# EAGLE design top (EAGLE 9.6.2)
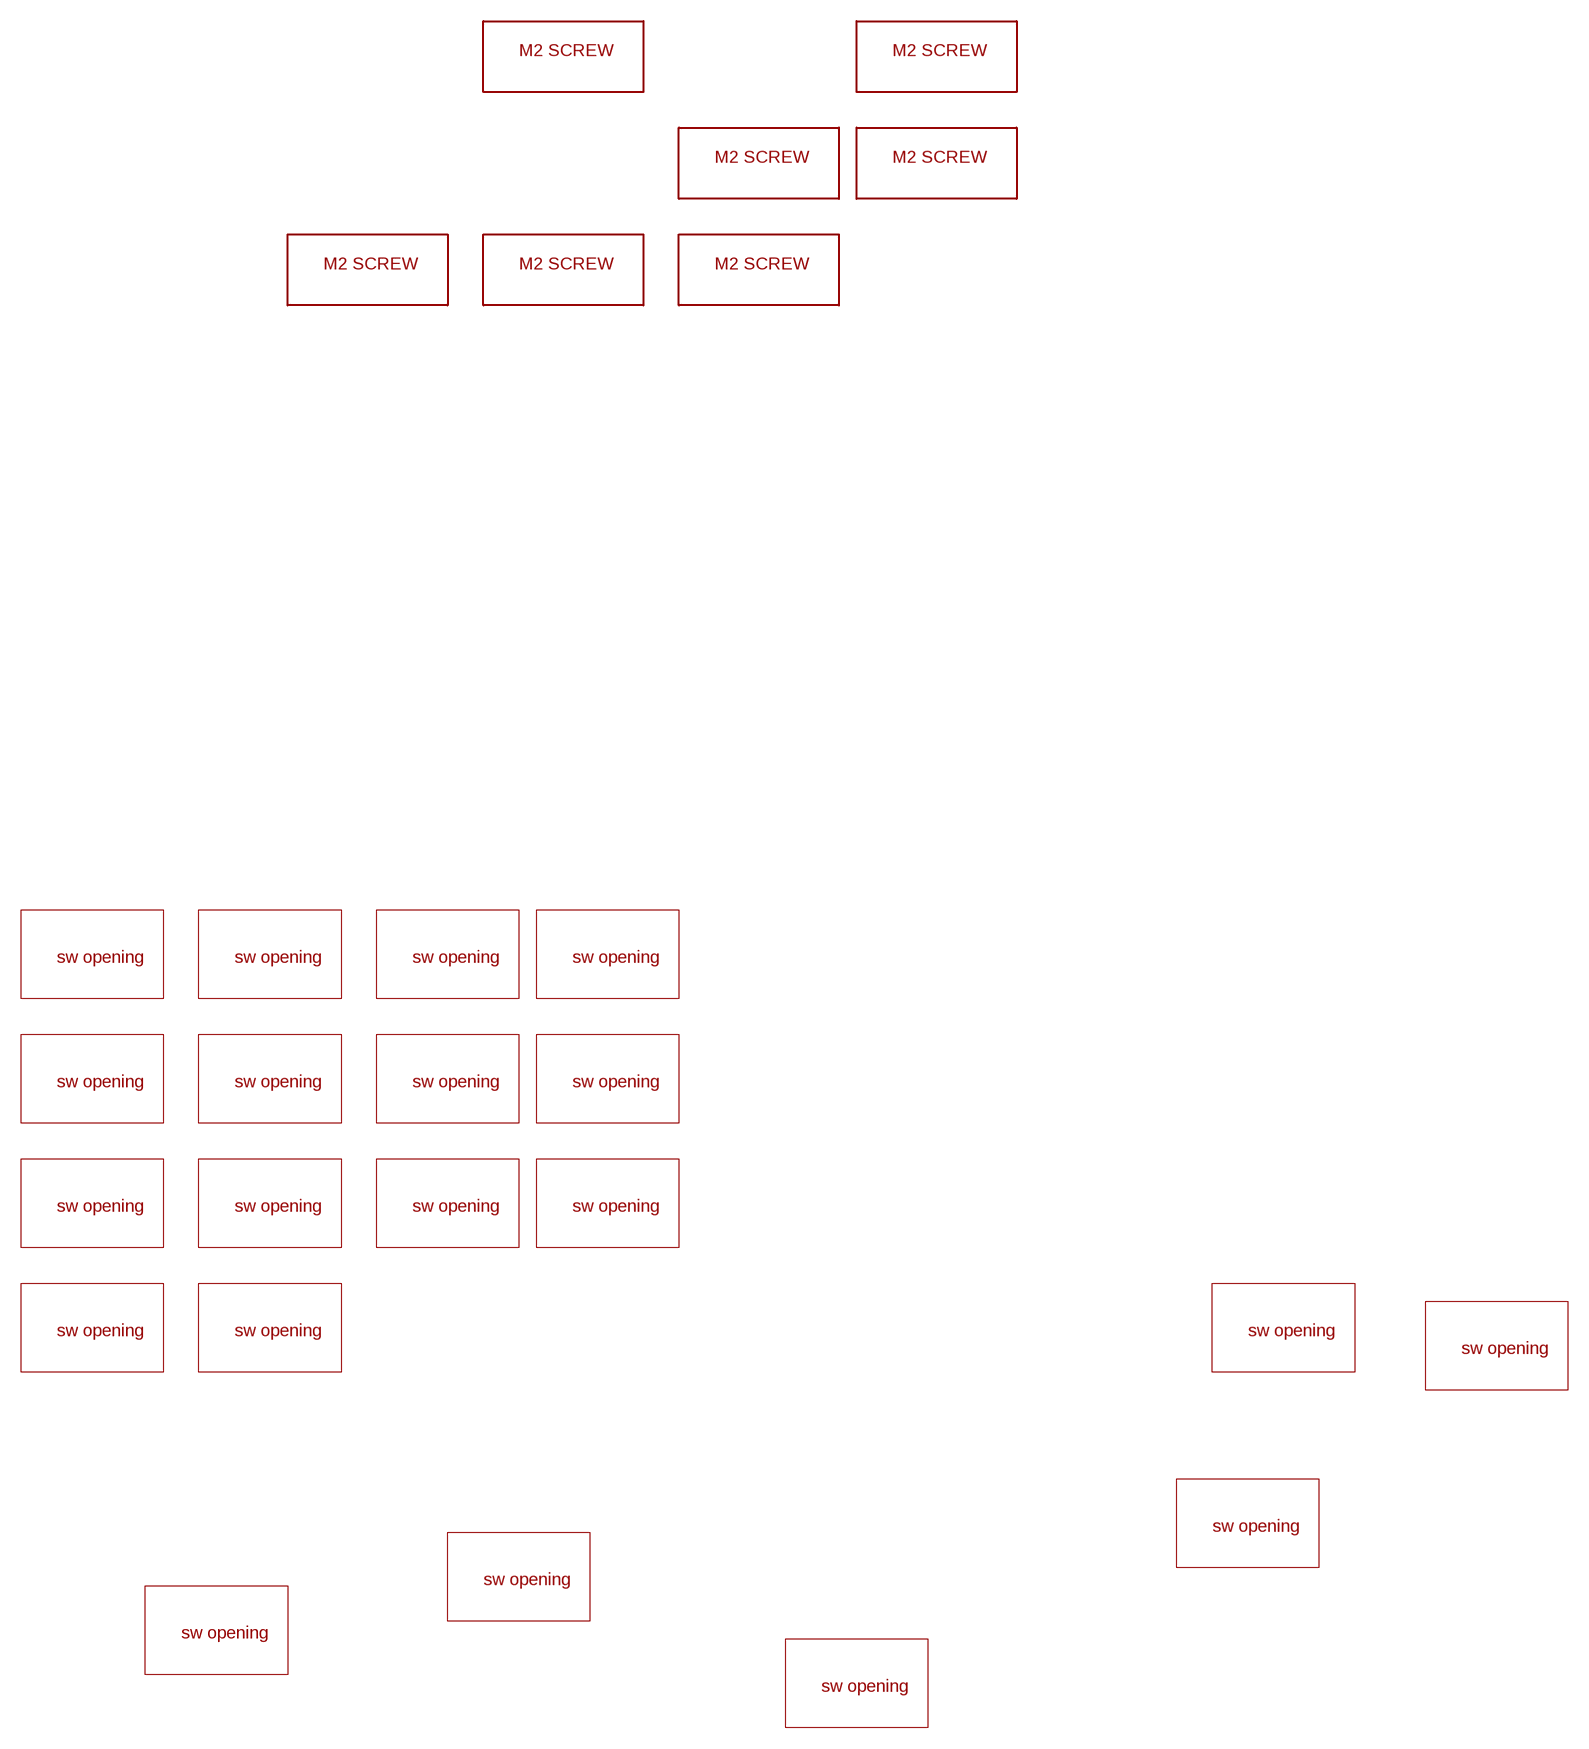
[diagram p0: schematic, sheet 1]

## Parts
U$1  SW_OPENM  [SW_OPENING]
U$2  SW_OPENM  [SW_OPENING]
U$3  SW_OPENM  [SW_OPENING]
U$4  SW_OPENM  [SW_OPENING]
U$5  SW_OPENM  [SW_OPENING]
U$6  SW_OPENM  [SW_OPENING]
U$7  SW_OPENM  [SW_OPENING]
U$8  M2_SCREW_DEV  [M2_SCREW_FOOT]
U$9  M2_SCREW_DEV  [M2_SCREW_FOOT]
U$10  SW_OPENM  [SW_OPENING]
U$11  SW_OPENM  [SW_OPENING]
U$12  M2_SCREW_DEV  [M2_SCREW_FOOT]
U$13  M2_SCREW_DEV  [M2_SCREW_FOOT]
U$14  M2_SCREW_DEV  [M2_SCREW_FOOT]
U$15  SW_OPENM  [SW_OPENING]
U$16  SW_OPENM  [SW_OPENING]
U$17  M2_SCREW_DEV  [M2_SCREW_FOOT]
U$18  SW_OPENM  [SW_OPENING]
U$19  SW_OPENM  [SW_OPENING]
U$20  SW_OPENM  [SW_OPENING]
U$21  SW_OPENM  [SW_OPENING]
U$22  M2_SCREW_DEV  [M2_SCREW_FOOT]
U$23  SW_OPENM  [SW_OPENING]
U$24  SW_OPENM  [SW_OPENING]
U$25  SW_OPENM  [SW_OPENING]
U$26  SW_OPENM  [SW_OPENING]
U$27  SW_OPENM  [SW_OPENING]

## Library data of the parts
U$1-U$7 U$10 U$11 U$15 U$16 U$18-U$21 U$23-U$27 = duckypad:SW_OPENM
U$8 U$9 U$12-U$14 U$17 U$22 = duckypad:M2_SCREW_DEV

## Board
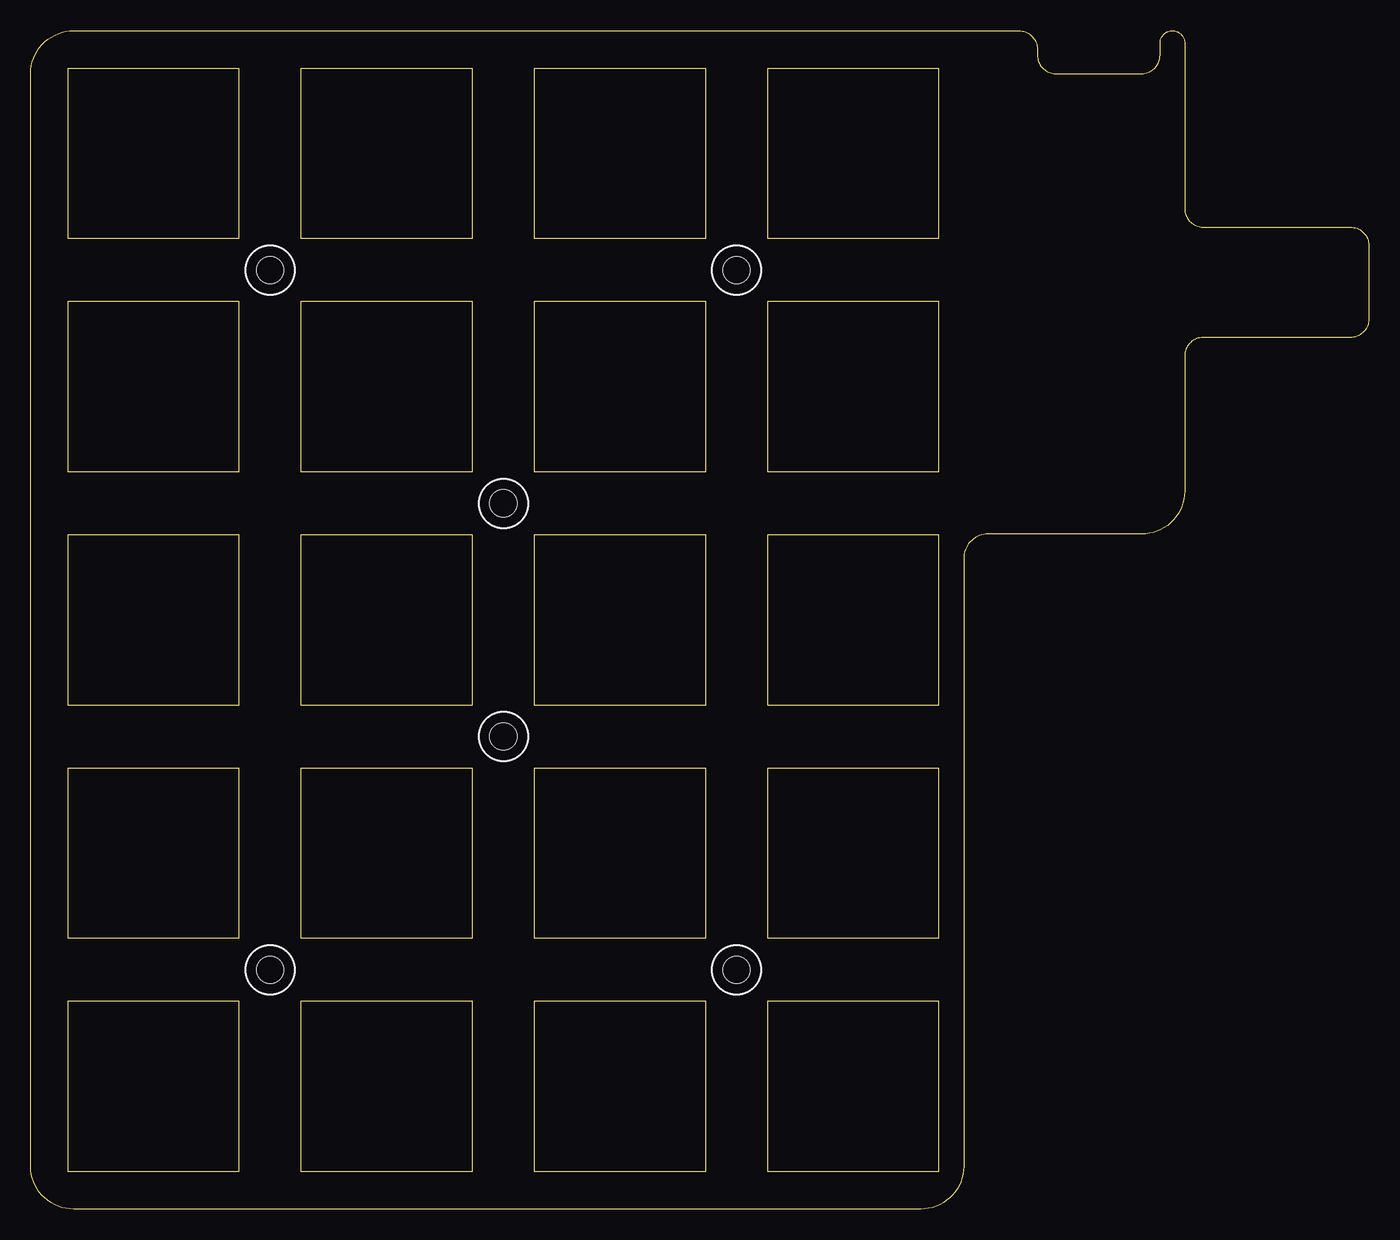
[diagram p1: board, top side]
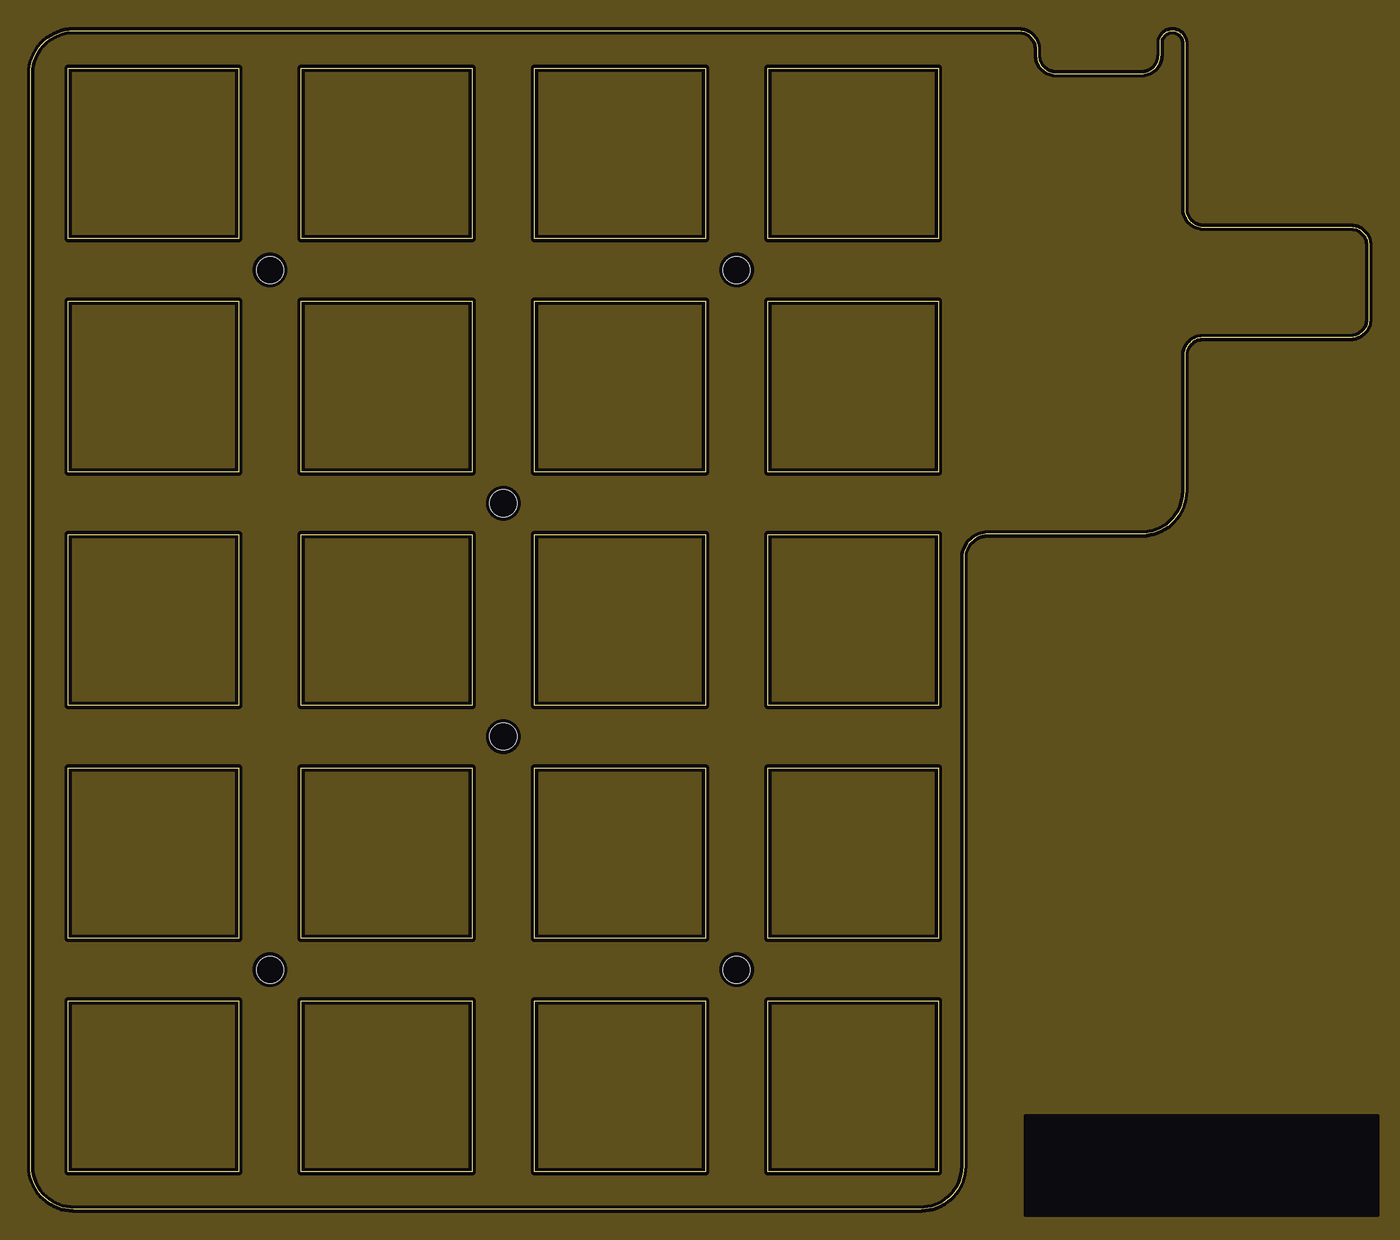
[diagram p2: board, inner layer pwr]
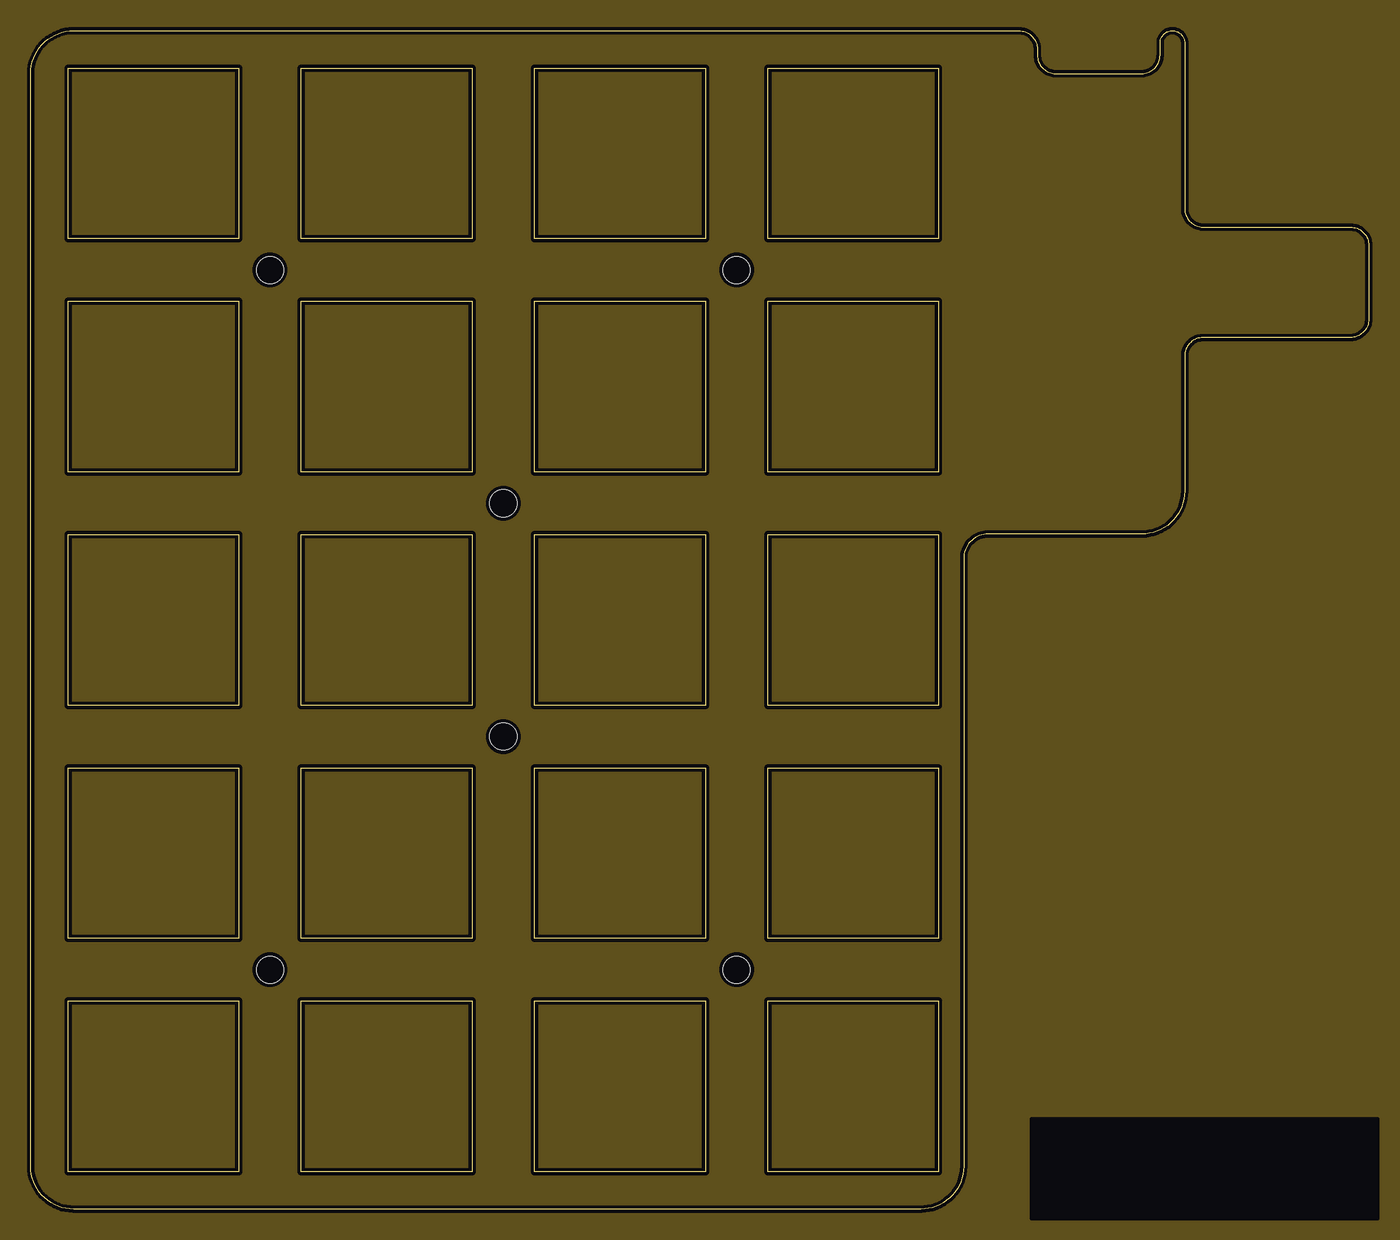
[diagram p3: board, inner layer gnd]
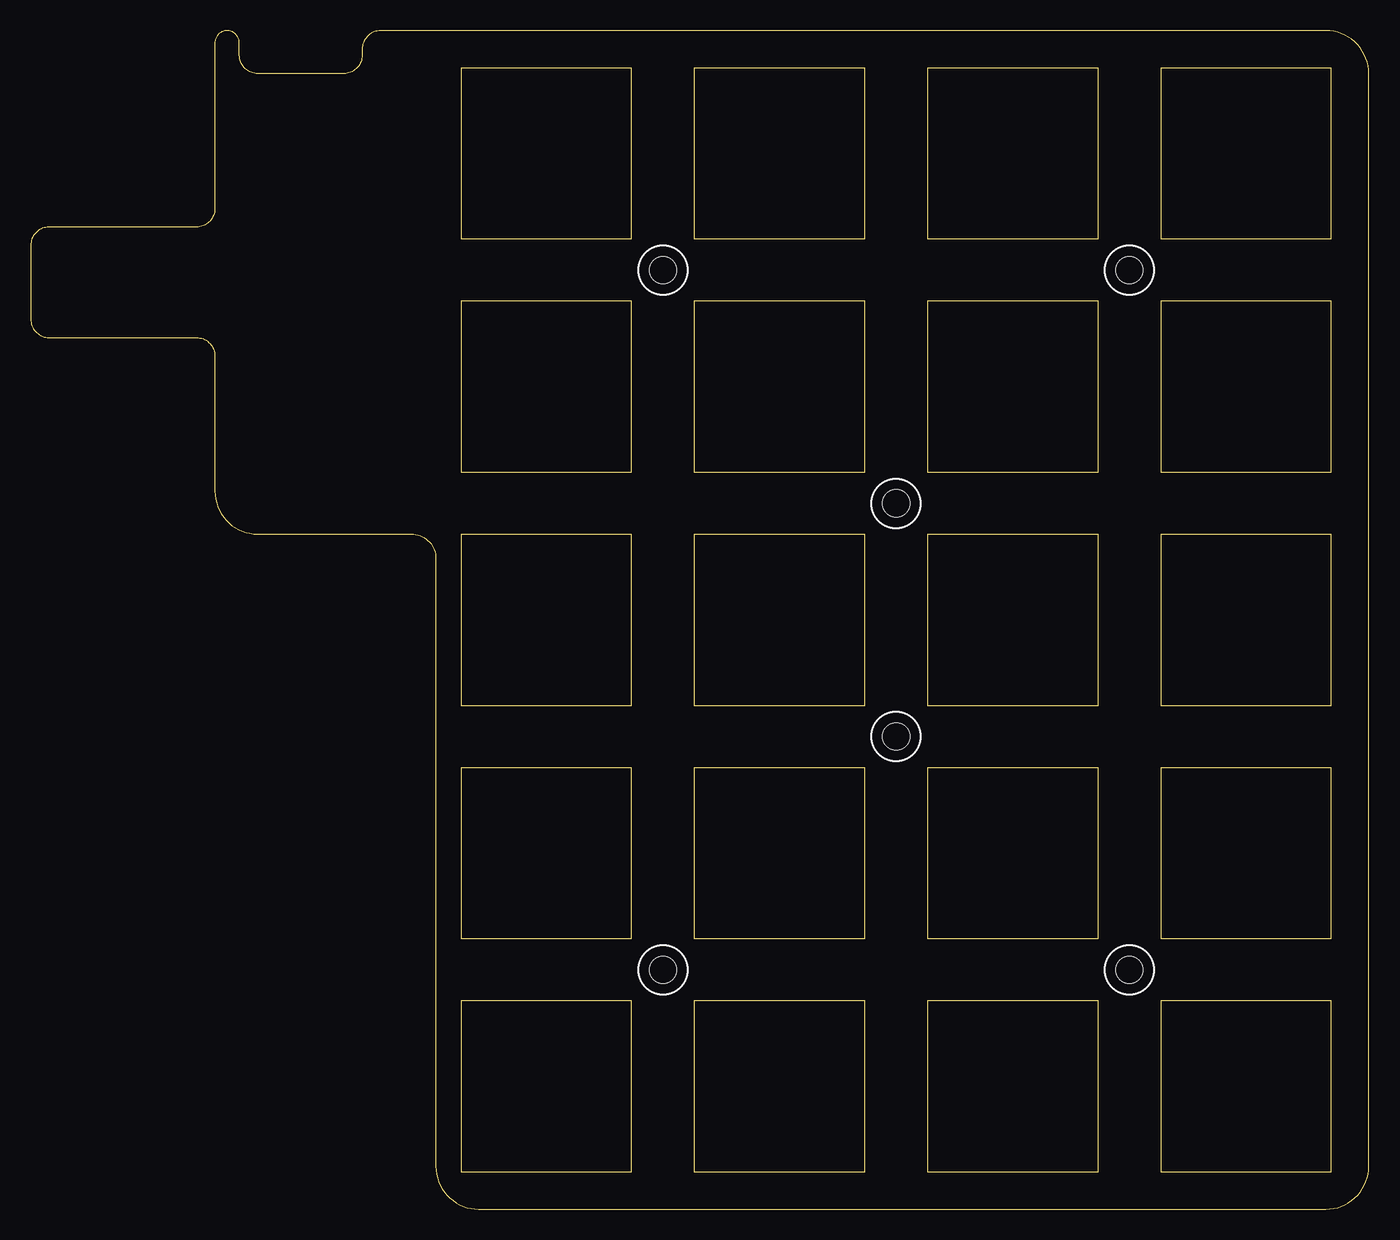
[diagram p4: board, bottom side, seen from below]

Size 109 x 96 mm. Coordinates in mm from the lower left corner, seen from the top.
Outline: 0,3.5 0,92.5 arc-90 3.5,96 80.5,96 arc-90 82,94.5 82,94 arc90 83.5,92.5 90.5,92.5 arc90 92,94 92,95 arc-90 93,96 arc-90 94,95 94,81.5 arc90 95.5,80 107.5,80 arc-90 109,78.5 109,72.5 arc-90 107.5,71 95.5,71 arc90 94,69.5 94,58.5 arc-90 90.5,55 78,55 arc90 76,53 76,3.5 arc-90 72.5,0 3.5,0 arc-90 0,3.5
Copper layers (1+2*15+16): Top 0.035559375mm / dielectric 0.47751875mm / pwr 0.035559375mm / dielectric 0.47751875mm / gnd 0.035559375mm / dielectric 0.47751875mm / Bottom 0.035559375mm
Design rules "SparkFun-4-Layer-General-JLCPCB *": minimum track width 6mil, minimum drill 12mil, track to track 6mil, track to pad 6mil, pad to pad 6mil, via to via 6mil, smd to smd 6mil, copper to edge 6mil, drill to drill 6mil, minimum pad ring 7mil, minimum via ring 7mil, stop-mask expansion 3mil, vias tented up to drill 25mil, thermal gap 10mil

### Footprints (pad centres in the part's own frame; a part is rotated, then mirrored left to right if it is on the bottom)
M2_SCREW_FOOT = hole 2.2: 0,0

### Placement (x,y rotation side)
U$1  10,10 0 top
U$2  29,10 0 top
U$3  48,10 0 top
U$4  67,10 0 top
U$5  10,29 0 top
U$6  29,29 0 top
U$7  48,29 0 top
U$8  38.5,57.5 0 top
U$9  57.5,76.5 0 top
U$10  67,29 0 top
U$11  10,48 0 top
U$12  38.5,38.5 0 top
U$13  57.5,19.5 0 top
U$14  19.5,76.5 0 top
U$15  29,48 0 top
U$16  48,48 0 top
U$18  67,48 0 top
U$19  10,67 0 top
U$20  10,86 0 top
U$21  29,67 0 top
U$22  19.5,19.5 0 top
U$23  48,67 0 top
U$24  67,67 0 top
U$25  29,86 0 top
U$26  48,86 0 top
U$27  67,86 0 top

### Tracks (layer width: path | path; a pad name or v marks a point on that pad's centre or on a via)
+3V3
  pour pwr (isolate 0.305): -6.48,107.7 127.13,107.7 127.13,-13.08 -6.48,-13.08
GND
  pour gnd (isolate 0.305): -11.81,111.38 130.05,111.38 130.05,-16.89 -11.81,-16.89
WTF2
  cutout gnd: 81.53,7.37 109.73,7.37 109.73,-0.76 81.53,-0.76
  cutout pwr (no thermals): 81.03,7.62 109.73,7.62 109.73,-0.51 81.03,-0.51

### Text on the board
tDocu: big round corner 3.5mm